# Altium schematic sheet Smart Stepper Fin - MCU MKL04Z16VFK4 .SchDoc
size A
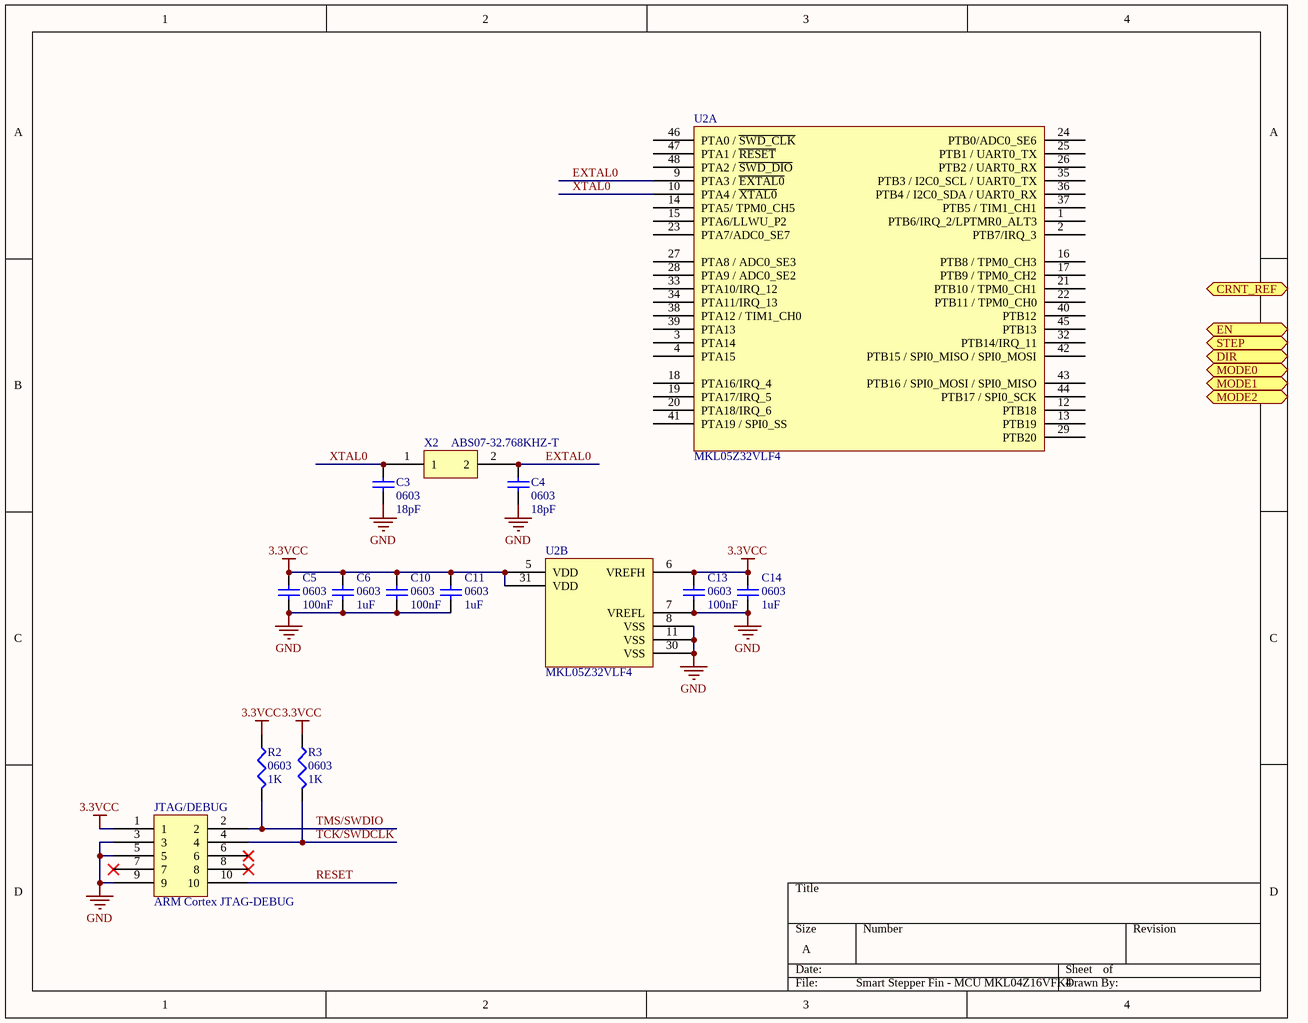
[diagram p0: Smart Stepper Fin - MCU MKL04Z16VFK4 .SchDoc]

## Parts
C3  0603  value 18pF  [1608[0603]]
C4  0603  value 18pF  [1608[0603]]
C5  0603  value 100nF  [1608[0603]]
C6  0603  value 1uF  [1608[0603]]
C10  0603  value 100nF  [1608[0603]]
C11  0603  value 1uF  [1608[0603]]
C13  0603  value 100nF  [1608[0603]]
C14  0603  value 1uF  [1608[0603]]
JTAG/DEBUG  ARM Cortex JTAG-DEBUG  [FTSH-105-XX-X-DV]
R2  0603  value 1K  [J1-0603]
R3  0603  value 1K  [J1-0603]
U2  MKL05Z32VLF4  [MKL05Z32VLF4]  (parts A,B of 2)
X2  ABS07-32.768KHZ-T  [ABS07-32.768KHZ-T]

## Ports
CRNT_REF, DIR, EN, MODE0, MODE1, MODE2, STEP

## Nets
3.3VCC: C5.2 C6.2 C10.2 C11.2 C13.1 C14.1 JTAG/DEBUG.1 R2.1 R3.1 U2.5(VDD) U2.6(VREFH) U2.31(VDD)
GND: C3.2 C4.2 C5.1 C6.1 C10.1 C11.1 C13.2 C14.2 JTAG/DEBUG.3 JTAG/DEBUG.5 JTAG/DEBUG.9 U2.7(VREFL) U2.8(VSS) U2.11(VSS) U2.30(VSS)
EXTAL0: C4.1 U2.9(PTA3_/_~{EXTAL0}) X2.2
RESET: JTAG/DEBUG.10
TCK/SWDCLK: JTAG/DEBUG.4 R3.2
TMS/SWDIO: JTAG/DEBUG.2 R2.2
XTAL0: C3.1 U2.10(PTA4_/_~{XTAL0}) X2.1

Not connected (* = marked no-connect by the designer): JTAG/DEBUG 6* 7* 8*; U2 1(PTB6/IRQ_2/LPTMR0_ALT3) 2(PTB7/IRQ_3) 3(PTA14) 4(PTA15) 12(PTB18) 13(PTB19) 14(PTA5/_TPM0_CH5) 15(PTA6/LLWU_P2) 16(PTB8_/_TPM0_CH3) 17(PTB9_/_TPM0_CH2) 18(PTA16/IRQ_4) 19(PTA17/IRQ_5) 20(PTA18/IRQ_6) 21(PTB10_/_TPM0_CH1) 22(PTB11_/_TPM0_CH0) 23(PTA7/ADC0_SE7) 24(PTB0/ADC0_SE6) 25(PTB1_/_UART0_TX) 26(PTB2_/_UART0_RX) 27(PTA8_/_ADC0_SE3) 28(PTA9_/_ADC0_SE2) 29(PTB20) 32(PTB14/IRQ_11) 33(PTA10/IRQ_12) 34(PTA11/IRQ_13) 35(PTB3_/_I2C0_SCL_/_UART0_TX) 36(PTB4_/_I2C0_SDA_/_UART0_RX) 37(PTB5_/_TIM1_CH1) 38(PTA12_/_TIM1_CH0) 39(PTA13) 40(PTB12) 41(PTA19_/_SPI0_SS) 42(PTB15_/_SPI0_MISO_/_SPI0_MOSI) 43(PTB16_/_SPI0_MOSI_/_SPI0_MISO) 44(PTB17_/_SPI0_SCK) 45(PTB13) 46(PTA0_/_~{SWD_CLK}) 47(PTA1_/_~{RESET}) 48(PTA2_/_~{SWD_DIO})

## Library data of the parts
C3-C6 C10 C11 C13 C14 = Cap Semi: Capacitor (Semiconductor SIM Model); Published: 8-Jun-2000; LatestRevisionDate: 29-May-2009; LatestRevisionNote: IPC-7351 Footprint Added.; PackageReference: C1206; Publisher: Altium Limited; PackageDescription: Chip Capacitor
JTAG/DEBUG = ARM Cortex JTAG-DEBUG Header
R2 R3 = Res3: Resistor; Published: 8-Jun-2000; LatestRevisionDate: 29-May-2009; LatestRevisionNote: IPC-7351 Footprint Added.; PackageReference: J1-0603; Publisher: Altium Limited; PackageDescription: Chip Resistor
U2 = MKL05Z32VLF4: ARM Cortex M0+
X2 = ABS07-32.768KHZ-T: ABS07-32.768KHZ-T RTC Crystal Oscillator